# Altium schematic sheet SH3 - NUCLEO HEADERS.SchDoc: Nucleo Headers
size B; CheckedBy: Wolfgang Windholtz; Engineer: Sahil Kale; Revision: 1.0; SheetNumber: 3; SheetTotal: 7
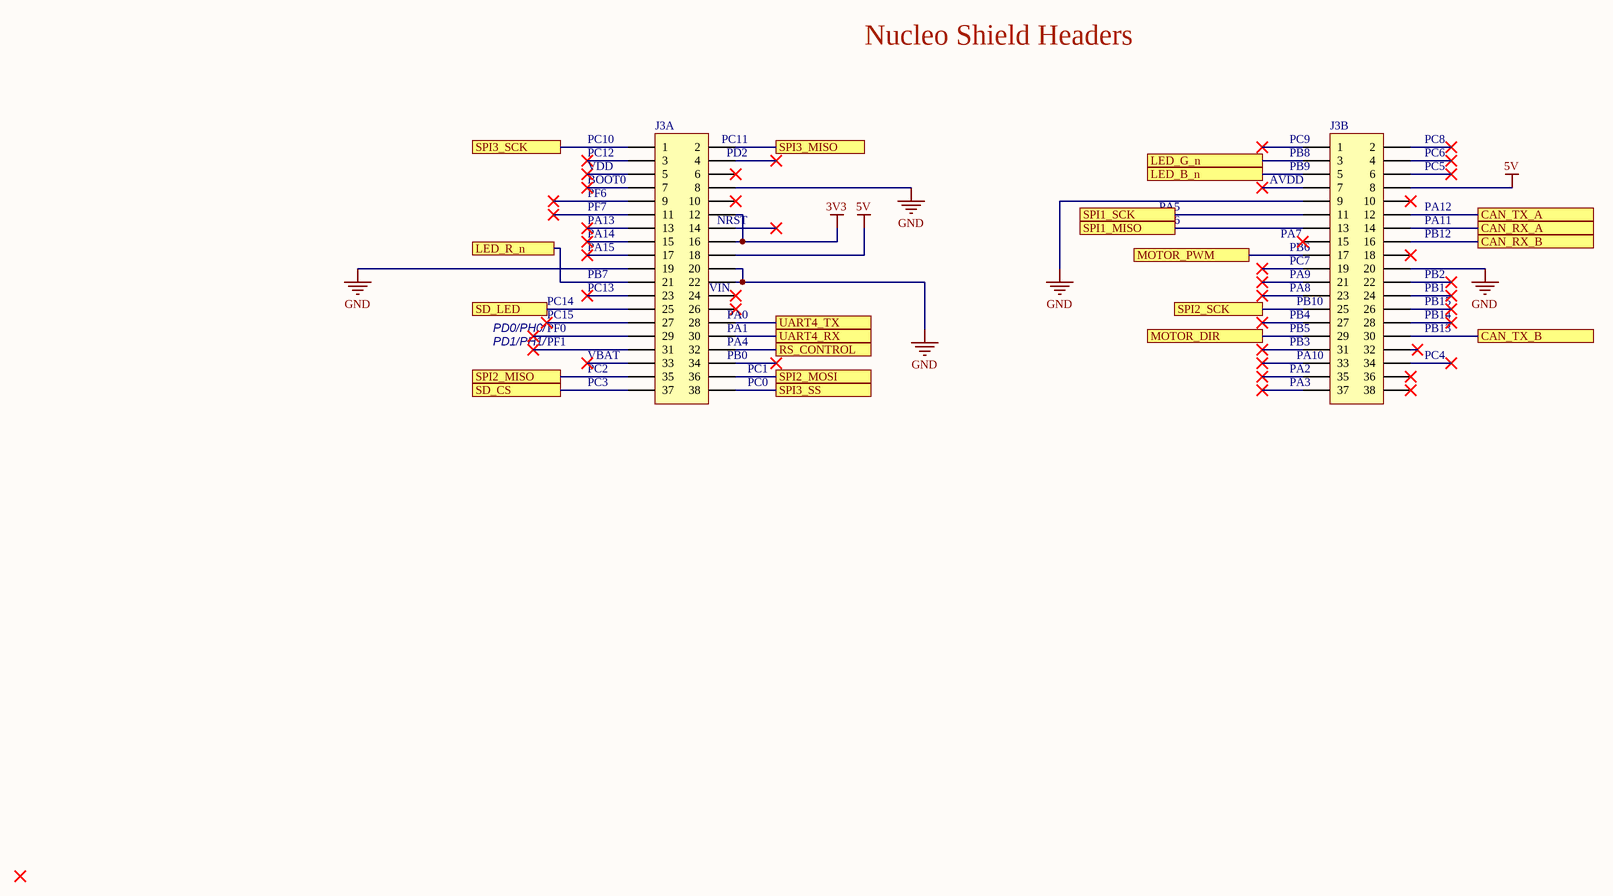
[diagram p0: SH3 - NUCLEO HEADERS.SchDoc]

## Parts
J3  HEADER_NUCLEO  [HEADER_NUCLEO]  (value not drawn)  (parts A,B of 2)

## Ports
CAN_RX_A, CAN_RX_B, CAN_TX_A, CAN_TX_B, LED_B_n, LED_G_n, LED_R_n, MOTOR_DIR, MOTOR_PWM, RS_CONTROL, SD_CS, SD_LED, SPI1_MISO, SPI1_SCK, SPI2_MISO, SPI2_MOSI, SPI2_SCK, SPI3_MISO, SPI3_SCK, SPI3_SS, UART4_RX, UART4_TX

## Nets
3V3: J3.12 J3.16
5V: J3.18 J3.46(8)
GND: J3.8 J3.19 J3.20 J3.22 J3.47(9) J3.58(20)
CAN_RX_A: J3.52(14) ; port CAN_RX_A
CAN_RX_B: J3.54(16) ; port CAN_RX_B
CAN_TX_A: J3.50(12) ; port CAN_TX_A
CAN_TX_B: J3.68(30) ; port CAN_TX_B
LED_B_n: J3.43(5) ; port LED_B_n
LED_G_n: J3.41(3) ; port LED_G_n
LED_R_n: J3.21 ; port LED_R_n
MOTOR_DIR: J3.67(29) ; port MOTOR_DIR
MOTOR_PWM: J3.55(17) ; port MOTOR_PWM
RS_CONTROL: J3.32 ; port RS_CONTROL
SD_CS: J3.37 ; port SD_CS
SD_LED: J3.25 ; port SD_LED
SPI1_MISO: J3.51(13) ; port SPI1_MISO
SPI1_SCK: J3.49(11) ; port SPI1_SCK
SPI2_MISO: J3.35 ; port SPI2_MISO
SPI2_MOSI: J3.36 ; port SPI2_MOSI
SPI2_SCK: J3.63(25) ; port SPI2_SCK
SPI3_MISO: J3.2 ; port SPI3_MISO
SPI3_SCK: J3.1 ; port SPI3_SCK
SPI3_SS: J3.38 ; port SPI3_SS
UART4_RX: J3.30 ; port UART4_RX
UART4_TX: J3.28 ; port UART4_TX

Not connected (* = marked no-connect by the designer): J3 3* 4* 5* 6* 7* 9* 10* 11* 13* 14* 15* 17* 23* 24* 26* 27* 29* 31* 33* 34* 39(1)* 40(2)* 42(4)* 44(6)* 45(7)* 48(10)* 53(15)* 56(18)* 57(19)* 59(21)* 60(22)* 61(23)* 62(24)* 64(26)* 65(27)* 66(28)* 69(31)* 70(32)* 71(33)* 72(34)* 73(35)* 74(36)* 75(37)* 76(38)*

## Notes on the sheet
- Nucleo Shield Headers
- (near J3) PC10
- (near J3) PC12
- (near J3) BOOT0
- (near J3) VDD
- (near J3) PC11
- (near J3) PD2
- (near J3) AVDD
- (near J3) PC9
- (near J3) PB8
- (near J3) PB9
- (near J3) PC8
- (near J3) PC6
- (near J3) PC5
- (near J3) PF7
- (near J3) PF6
- (near J3) PA13
- (near J3) PA14
- (near J3) NRST
- PA5
- PA6
- (near J3) PA7
- (near J3) PA12
- (near J3) PA11
- (near J3) PB12
- PC14
- PC15
- (near J3) PA15
- (near J3) PB7
- (near J3) PC13
- (near J3) VIN
- (near J3) PA0
- (near J3) PB6
- (near J3) PC7
- (near J3) PA9
- (near J3) PA8
- (near J3) PB4
- (near J3) PB10
- (near J3) PB1
- (near J3) PB2
- (near J3) PB15
- (near J3) PB14
- PD0/PH0/
- PD1/PH1/
- PF0
- PF1
- (near J3) PC2
- (near J3) VBAT
- (near J3) PA1
- (near J3) PA4
- (near J3) PB0
- (near J3) PC1
- (near J3) PB5
- (near J3) PB3
- (near J3) PA2
- (near J3) PA10
- (near J3) PC4
- (near J3) PB13
- (near J3) PC3
- (near J3) PC0
- (near J3) PA3
- Title:
- Project:
- Date:
- Rev:
- Checker:
- Engineer:
- Sheet:
- of

## Library data of the parts
J3 = HEADER_NUCLEO: CONN HDR 38POS 0.1 GOLD PCB; Manufacturer 1: Sullins; Manufacturer Part Number 1: PPPC192LFBN-RC; Package/Footprint: TH; Supplier 1: Digi-Key; Supplier Part Number 1: S7122-ND; Mounting Type: TH; Verified: No; LCSC Part #: *